# Altium project bridgH_Project.PrjPcb
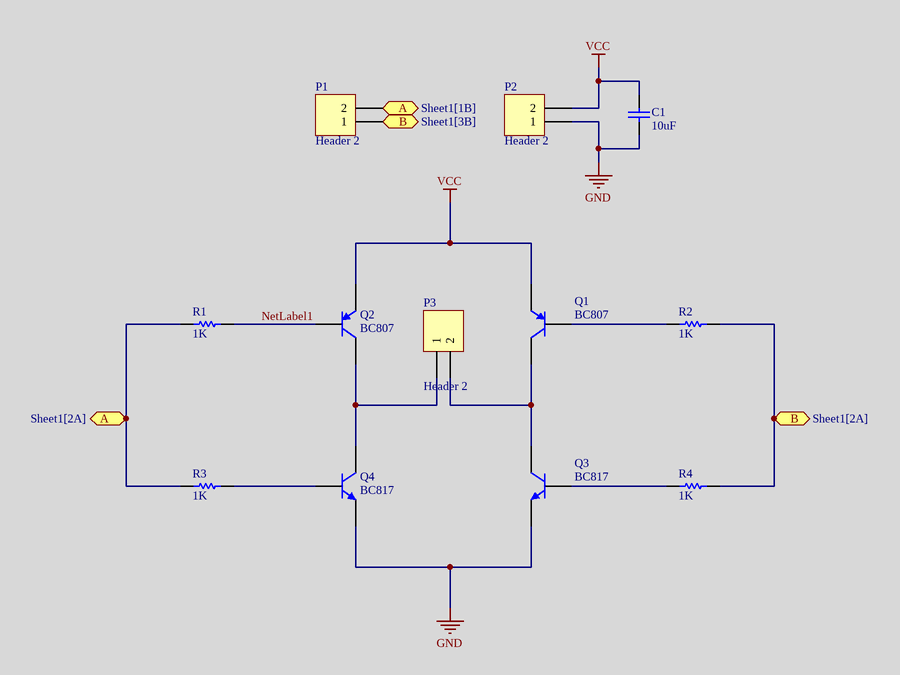
[diagram p0: Sheet1.SchDoc]
1 sheet, 12 parts. Net scope: flat (ports and power ports of the same name join across sheets).
Board files: PCB1.PcbDoc, PCB2.PcbDoc

## Sheet Sheet1.SchDoc
size A; SheetNumber: 1; SheetTotal: 1

### Parts
C1  10uF  [CAP1206]
P1  Header 2  [HDR1X2]
P2  Header 2  [HDR1X2]
P3  Header 2  [HDR1X2]
Q1  BC807  [SOT23_BEC_N]
Q2  BC807  [SOT23_BEC_N]
Q3  BC817  [SOT23_BEC_N]
Q4  BC817  [SOT23_BEC_N]
R1  1K  [RES1206]
R2  1K  [RES1206]
R3  1K  [RES1206]
R4  1K  [RES1206]

### Ports
A (bidir, see Sheet1[1B]), A (bidir, see Sheet1[2A]), B (bidir, see Sheet1[2A]), B (bidir, see Sheet1[3B])

### Nets
GND: C1.1 P2.1 Q3.2(E) Q4.2(E)
VCC: C1.2 P2.2 Q1.2(E) Q2.2(E)
NetLabel1: Q2.1(B) R1.2
NetP1_1: P1.1 R2.2 R4.2 ; port B
NetP1_2: P1.2 R1.1 R3.1 ; port A
NetP3_1: P3.1 Q2.3(C) Q4.3(C)
NetP3_2: P3.2 Q1.3(C) Q3.3(C)
NetQ1_1: Q1.1(B) R2.1
NetQ3_1: Q3.1(B) R4.1
NetQ4_1: Q4.1(B) R3.2

### Library data of the parts
C1 = CAP SMD PACKAGE: TOTAL CAPACITOR SMD PACK; Designer: Abbas Basereh; Desc.: CAP SMD TOTAL PACKAGES; Data: 2017-3-10; VALUE: 10uF
P1-P3 = Header 2: Header, 2-Pin; LatestRevisionDate: 17-Jul-2002; LatestRevisionNote: Re-released for DXP Platform.; Publisher: Altium Limited
Q1 Q2 = PNP: PNP Bipolar Transistor; Published: 8-Jun-2000; LatestRevisionDate: 29-May-2009; LatestRevisionNote: IPC-7351 Footprint Added.; PackageVersion: Aug-1999; PackageReference: SOT-23B; Publisher: Altium Limited; PackageDescription: 3-Pin SOT-23 Package 0.95 mm Pitch, 2.4 mm Lead Span
Q3 Q4 = NPN: NPN Bipolar Transistor; Published: 8-Jun-2000; LatestRevisionDate: 29-May-2009; LatestRevisionNote: IPC-7351 Footprint Added.; PackageVersion: Aug-1999; PackageReference: SOT-23B; Publisher: Altium Limited; PackageDescription: 3-Pin SOT-23 Package 0.95 mm Pitch, 2.4 mm Lead Span
R1-R4 = RES SMD PACKAGE: TOTAL SMD RESISTOR PACK; Designer: Abbas Basereh; Desc.: RES SMD PAKAGES; Data: 2017-3-10